# EAGLE design rev b (EAGLE 7.6.0)
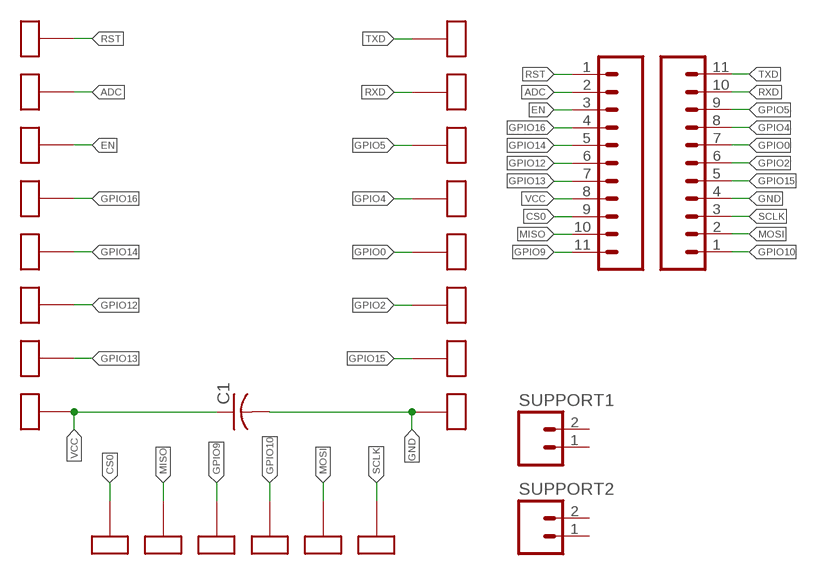
[diagram p0: schematic, sheet 1]

## Parts
C1  C-USC0805  [C0805]
JP1  M11LOCK  [1X11_LOCK]
JP2  M11LOCK  [1X11_LOCK]
SUPPORT1  M02LOCK  [1X02_LOCK]
SUPPORT2  M02LOCK  [1X02_LOCK]
U$2  1MMPOGO  [1MMPOGO]
U$3  1MMPOGO  [1MMPOGO]
U$4  1MMPOGO  [1MMPOGO]
U$5  1MMPOGO  [1MMPOGO]
U$6  1MMPOGO  [1MMPOGO]
U$7  1MMPOGO  [1MMPOGO]
U$8  1MMPOGO  [1MMPOGO]
U$9  1MMPOGO  [1MMPOGO]
U$10  1MMPOGO  [1MMPOGO]
U$11  1MMPOGO  [1MMPOGO]
U$12  1MMPOGO  [1MMPOGO]
U$13  1MMPOGO  [1MMPOGO]
U$14  1MMPOGO  [1MMPOGO]
U$15  1MMPOGO  [1MMPOGO]
U$16  1MMPOGO  [1MMPOGO]
U$17  1MMPOGO  [1MMPOGO]
U$18  1MMPOGO  [1MMPOGO]
U$19  1MMPOGO  [1MMPOGO]
U$20  1MMPOGO  [1MMPOGO]
U$21  1MMPOGO  [1MMPOGO]
U$22  1MMPOGO  [1MMPOGO]
U$23  1MMPOGO  [1MMPOGO]

## Nets
ADC: JP1.2 U$3.POGO(P)
CS0: JP1.9 U$10.POGO(P)
EN: JP1.3 U$4.POGO(P)
GND: C1.2 JP2.4 U$16.POGO(P)
GPIO0: JP2.7 U$19.POGO(P)
GPIO2: JP2.6 U$18.POGO(P)
GPIO4: JP2.8 U$20.POGO(P)
GPIO5: JP2.9 U$21.POGO(P)
GPIO9: JP1.11 U$12.POGO(P)
GPIO10: JP2.1 U$13.POGO(P)
GPIO12: JP1.6 U$7.POGO(P)
GPIO13: JP1.7 U$8.POGO(P)
GPIO14: JP1.5 U$6.POGO(P)
GPIO15: JP2.5 U$17.POGO(P)
GPIO16: JP1.4 U$5.POGO(P)
MISO: JP1.10 U$11.POGO(P)
MOSI: JP2.2 U$14.POGO(P)
RST: JP1.1 U$2.POGO(P)
RXD: JP2.10 U$22.POGO(P)
SCLK: JP2.3 U$15.POGO(P)
TXD: JP2.11 U$23.POGO(P)
VCC: C1.1 JP1.8 U$9.POGO(P)
Unconnected: SUPPORT1.1 SUPPORT1.2 SUPPORT2.1 SUPPORT2.2

## Library data of the parts
C1 = rcl:C-US: CAPACITOR, American symbol
JP1 JP2 = SparkFun-Connectors:M11: Header 11 Standard 11-pin 0.1" header. Use with straight break away headers (SKU : PRT-00116), right angle break away headers (PRT-00553), swiss pins (PRT-00743), machine pins (PRT-00117), and female headers (PRT-00115).
SUPPORT1 SUPPORT2 = SparkFun-Connectors:M02: Standard 2-pin 0.1" header. Use with - straight break away headers ( PRT-00116) - right angle break away headers (PRT-00553) - swiss pins (PRT-00743) - machine pins (PRT-00117) - female headers (PRT-00115) Molex polarized connector foot print use with: PRT-08233 with associated crimp pins and housings. 2.54_SCREWTERM for use with PRT-10571. 3.5mm Screw Terminal footprints for PRT-08084 5mm Screw Terminal footprints for use with PRT-08432
U$2-U$23 = custom:1MMPOGO

## Board
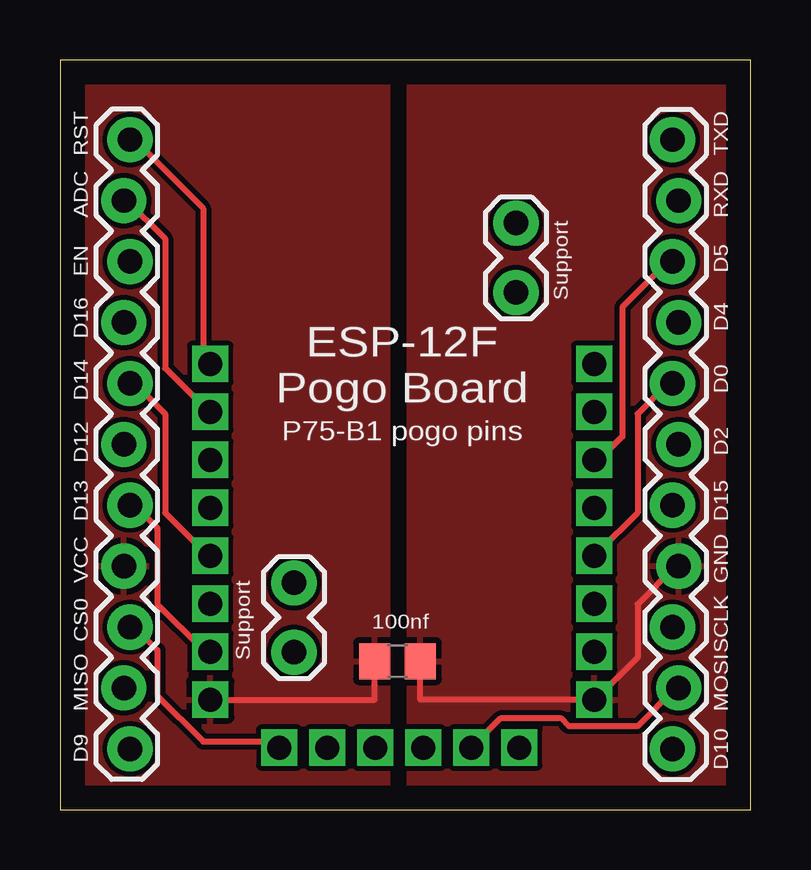
[diagram p1: board, top side]
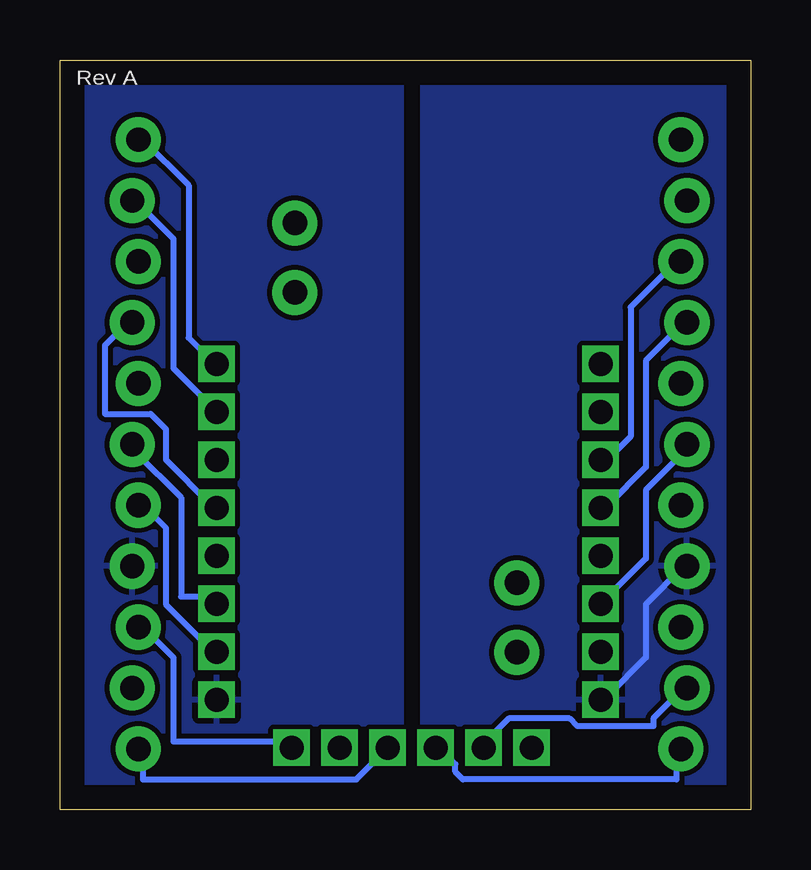
[diagram p2: board, bottom side, seen from below]

Size 28.79 x 31.26 mm. Coordinates in mm from the lower left corner, seen from the top.
Outline: 0,0 28.79,0 28.79,31.26 0,31.26 0,0
Copper layers (1*16): Top 0.035mm / dielectric 1.5mm / Bottom 0.035mm
Design rules "default": minimum track width 10mil, minimum drill 24mil, track to track 8mil, track to pad 8mil, pad to pad 8mil, via to via 8mil, smd to smd 8mil, copper to edge 40mil, drill to drill 8mil, minimum pad ring 10mil, minimum via ring 8mil, stop-mask expansion 4mil, vias tented up to drill 0mil, thermal gap 10mil

### Footprints (pad centres in the part's own frame; a part is rotated, then mirrored left to right if it is on the bottom)
C0805 = smd 1.3 x 1.5: 1 -0.95,0; 2 0.95,0
1X11_LOCK = drill 1.016 pad 1.88: 1 0,0.127; 2 2.54,-0.127; 3 5.08,0.127; 4 7.62,-0.127; 5 10.16,0.127; 6 12.7,-0.127; 7 15.24,0.127; 8 17.78,-0.127; 9 20.32,0.127; 10 22.86,-0.127; 11 25.4,0.127
1X02_LOCK = drill 1.016 pad 1.88: 1 -0.178,0; 2 2.718,0
1MMPOGO = drill 1 pad 1.5 square: POGO 0,0

### Placement (x,y rotation side)
C1  14.06,6.2 0 top
JP1  2.79,27.94 270 top
JP2  25.65,2.54 90 top
SUPPORT1  9.75,6.75 90 top
SUPPORT2  19,21.75 90 top
U$2  6.26,18.59 0 top
U$3  6.26,16.59 0 top
U$4  6.26,14.6 0 top
U$5  6.26,12.6 0 top
U$6  6.26,10.6 0 top
U$7  6.26,8.6 0 top
U$8  6.26,6.59 0 top
U$9  6.26,4.59 0 top
U$10  9.14,2.6 0 top
U$11  11.14,2.6 0 top
U$12  13.14,2.6 0 top
U$13  15.14,2.6 0 top
U$14  17.14,2.6 0 top
U$15  19.14,2.6 0 top
U$16  22.26,4.59 0 top
U$17  22.26,6.59 0 top
U$18  22.26,8.6 0 top
U$19  22.26,10.6 0 top
U$20  22.26,12.6 0 top
U$21  22.26,14.6 0 top
U$22  22.26,16.59 0 top
U$23  22.26,18.59 0 top

### Tracks (layer width: path | path; a pad name or v marks a point on that pad's centre or on a via)
ADC
  Top 0.254: U$3.POGO 5.96,16.83 4.38,18.41 4.38,23.81 2.79,25.4 JP1.2
CS0
  Top 0.254: U$10.POGO 8.82,2.86 5.96,2.86 4.06,4.76 4.06,6.67 3.11,7.62 JP1.9
EN
  Bottom 0.254: U$4.POGO 5.96,14.61 5.01,15.56 5.01,20.95 3.11,22.86 JP1.3
GND
  Top 0.254: JP2.4 25.65,10.16 24.06,8.57 24.06,6.35 22.48,4.76 U$16.POGO 15.01,4.59 C1.2
  pour Bottom: 28.9,0 14.58,0 14.58,31.39 28.9,31.39
  pour Top: 28.9,0 14.58,0 14.58,31.39 28.9,31.39
GPIO0
  Top 0.254: U$19.POGO 22.48,10.79 24.06,12.38 24.06,16.51 25.33,17.78 JP2.7
GPIO2
  Bottom 0.254: U$18.POGO 22.48,8.89 23.75,8.89 23.75,13.02 25.65,14.92 25.65,15.24 JP2.6
GPIO4
  Bottom 0.254: U$20.POGO 22.48,12.7 24.38,14.61 24.38,15.88 25.02,16.51 26.92,16.51 26.92,19.37 25.97,20.32 JP2.8
GPIO5
  Top 0.254: U$21.POGO 22.48,14.61 23.43,15.56 23.43,20.95 25.33,22.86 JP2.9
GPIO9
  Bottom 0.254: U$12.POGO 12.95,2.54 12.31,1.91 12.31,1.59 12,1.27 3.11,1.27 3.11,2.54 JP1.11
GPIO10
  Bottom 0.254: U$13.POGO 15.17,2.54 16.44,1.27 25.33,1.27 25.33,2.54 JP2.1
GPIO12
  Bottom 0.254: U$7.POGO 5.96,8.89 4.38,10.48 4.38,13.34 2.79,14.92 2.79,15.24 JP1.6
GPIO13
  Top 0.254: U$8.POGO 5.96,6.67 4.06,8.57 4.06,11.75 3.11,12.7 JP1.7
GPIO14
  Top 0.254: U$6.POGO 5.96,10.79 4.38,12.38 4.38,16.51 3.11,17.78 JP1.5
GPIO15
  Bottom 0.254: U$17.POGO 22.48,6.67 24.38,8.57 24.38,11.75 25.33,12.7 JP2.5
GPIO16
  Bottom 0.254: U$5.POGO 5.96,12.7 4.38,14.29 4.38,18.73 2.79,20.32 JP1.4
MISO
  Bottom 0.254: U$11.POGO 11.04,2.86 10.09,3.81 7.55,3.81 7.24,3.49 4.06,3.49 4.06,3.81 2.79,5.08 JP1.10
MOSI
  Top 0.254: U$14.POGO 17.39,2.86 18.35,3.81 20.89,3.81 21.2,3.49 24.06,3.49 25.65,5.08 JP2.2
RST
  Top 0.254: U$2.POGO 5.96,18.73 5.96,25.08 3.11,27.94 JP1.1
RXD
  Bottom 0.254: U$22.POGO 22.48,16.83 24.06,18.41 24.06,23.81 25.65,25.4 JP2.10
SCLK
  Bottom 0.254: U$15.POGO 19.3,2.86 24.06,2.86 24.06,6.35 25.33,7.62 JP2.3
TXD
  Bottom 0.254: U$23.POGO 22.48,18.73 23.43,19.68 23.43,26.04 25.33,27.94 JP2.11
VCC
  Top 0.254: U$9.POGO 13.11,4.59 C1.1
  Bottom 0.254: U$9.POGO 5.96,4.76 4.38,6.35 4.38,8.57 2.79,10.16 JP1.8
  pour Bottom: 0,0 13.66,0 13.66,31.39 0,31.39
  pour Top: 0,0 13.66,0 13.66,31.39 0,31.39

### Text on the board
tPlace: RST | TXD | ADC | RXD | EN | D5 | Support | D16 | D4 | ESP-12F / Pogo Board | D14 | D0 | P75-B1 pogo pins | D2 | D12 | D13 | D15 | VCC | GND | 100nf | CS0 | SCLK | Support | MISO | MOSI | D9 | D10
bPlace: Rev A